# Altium schematic sheet Mechanical.SchDoc: Mechanical
size A4; Date: Not used; ApprovedBy: Not used; CheckedBy: Not used; Author: Not used; CompanyName: STMicroelectronics; DrawnBy: Not used; Engineer: Not used; Organization: Not used; Address1: Not used; Address2: Not used; Address3: Not used; Address4: Not used; DocumentNumber: Not used; Revision: Not used; SheetNumber: 7; SheetTotal: 7; CurrentTime: Not used; CurrentDate: Not used; Time: Not used; DocumentFullPathAndName: Not used; DocumentName: Not used; ModifiedDate: Not used; ImagePath: Not used; ProjectName: Not used; Application_BuildNumber: Not used
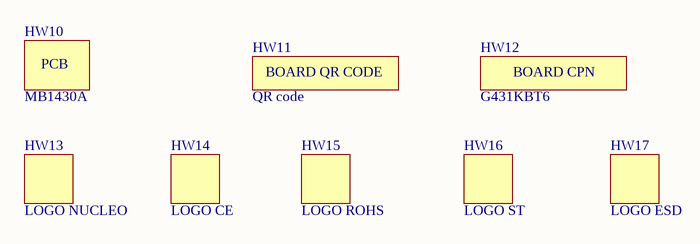
[diagram p0: Mechanical.SchDoc]

## Parts
HW10  value MB1430A  (mechanical)
HW11  value QR code  [STICKER_BOARD-QR-CODE_9X9]  (hidden comment: STICKER_BOARD-QR-CODE)  (mechanical)
HW12  value G431KBT6  [STICKER_BOARD-CPN_13X3]  (hidden comment: STICKER_BOARD_CPN)  (mechanical)
HW13  value LOGO NUCLEO  [LOGO_NUCLEO]  (no BOM)
HW14  value LOGO CE  [LOGO_CE]  (no BOM)
HW15  value LOGO ROHS  [LOGO_ROHS]  (no BOM)
HW16  value LOGO ST  [LOGO_ST]  (no BOM)
HW17  value LOGO ESD  [LOGO_MAIN_1]  (no BOM)

## Notes on the sheet
- Title:
- Project:
- Size:
- Revision:
- Variant:
- A4
- -
- Date:
- Reference:
- Sheet:
- of
- (in symbol MCD-01470) BOARD CPN
- (in symbol MCD-01471) BOARD QR CODE

## Library data of the parts
HW10 = MCD-00216: PCB, xxxx for PCB number, Y for PCB revision; Part_Type: Mechanical; Provided_By: SUBCO; Initial_Board_Reference: MB1319; Internal_Part_Number: MCD-00216; Status: Released; ComponentLink1Description: Datasheet; Manufacturer_Part_Number: n/a; Manufacturer: n/a
HW11 = MCD-01471: Sticker to mention QR code on small board size (ie Nucleo-32); Part_Type: Mechanical; Provided_By: SUBCO; Initial_Board_Reference: MB1430; Internal_Part_Number: MCD-01471; Status: Footprint available; Manufacturer_Part_Number: n/a; Manufacturer: n/a; ComponentLink1Description: Datasheet; ComponentLink1URL: n/a
HW12 = MCD-01470: Small sticker to mention board CPN (6 digits CPN + last ones FG); Part_Type: Mechanical; Provided_By: SUBCO; Initial_Board_Reference: MB1430; Internal_Part_Number: MCD-01470; Status: Footprint available; Manufacturer_Part_Number: n/a; Manufacturer: n/a; ComponentLink1Description: Datasheet; ComponentLink1URL: n/a
HW13 = MCD-00636: NUCLEO logo footprint for PCB; Part_Type: Mechanical; Initial_Board_Reference: MB1331; Internal_Part_Number: MCD-00636; Status: Released; Provided_By: n/a; ComponentLink1Description: Datasheet
HW14 = MCD-00626: CE logo footprint for PCB; Part_Type: Mechanical; Initial_Board_Reference: MB1331; Internal_Part_Number: MCD-00626; Status: Released; Provided_By: n/a; ComponentLink1Description: Datasheet
HW15 = MCD-00628: ROHS logo footprint for PCB; Part_Type: Mechanical; Initial_Board_Reference: MB1331; Internal_Part_Number: MCD-00628; Status: Released; Provided_By: n/a; ComponentLink1Description: Datasheet
HW16 = MCD-00625: STMicroelectronics logo footprint for PCB; Part_Type: Mechanical; Initial_Board_Reference: MB1331; Internal_Part_Number: MCD-00625; Status: Released; Provided_By: n/a; Manufacturer_Part_Number: n/a; Manufacturer: n/a; ComponentLink1Description: Datasheet; ComponentLink1URL: http://na
HW17 = MCD-00627: Hand ESD logo footprint for PCB; Part_Type: Mechanical; Initial_Board_Reference: MB1331; Internal_Part_Number: MCD-00627; Status: Released; Provided_By: n/a; Manufacturer_Part_Number: n/a; Manufacturer: n/a; ComponentLink1Description: Datasheet; ComponentLink1URL: http://na